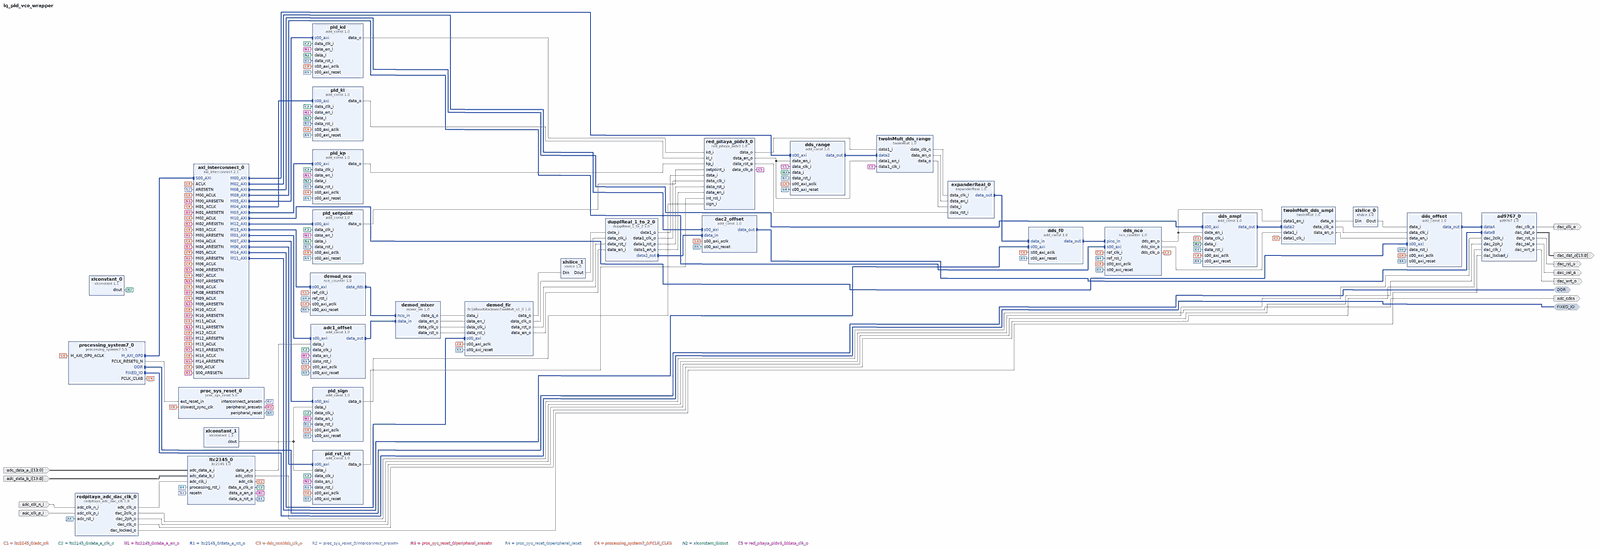
[diagram p0: block diagram of the top level, whole]
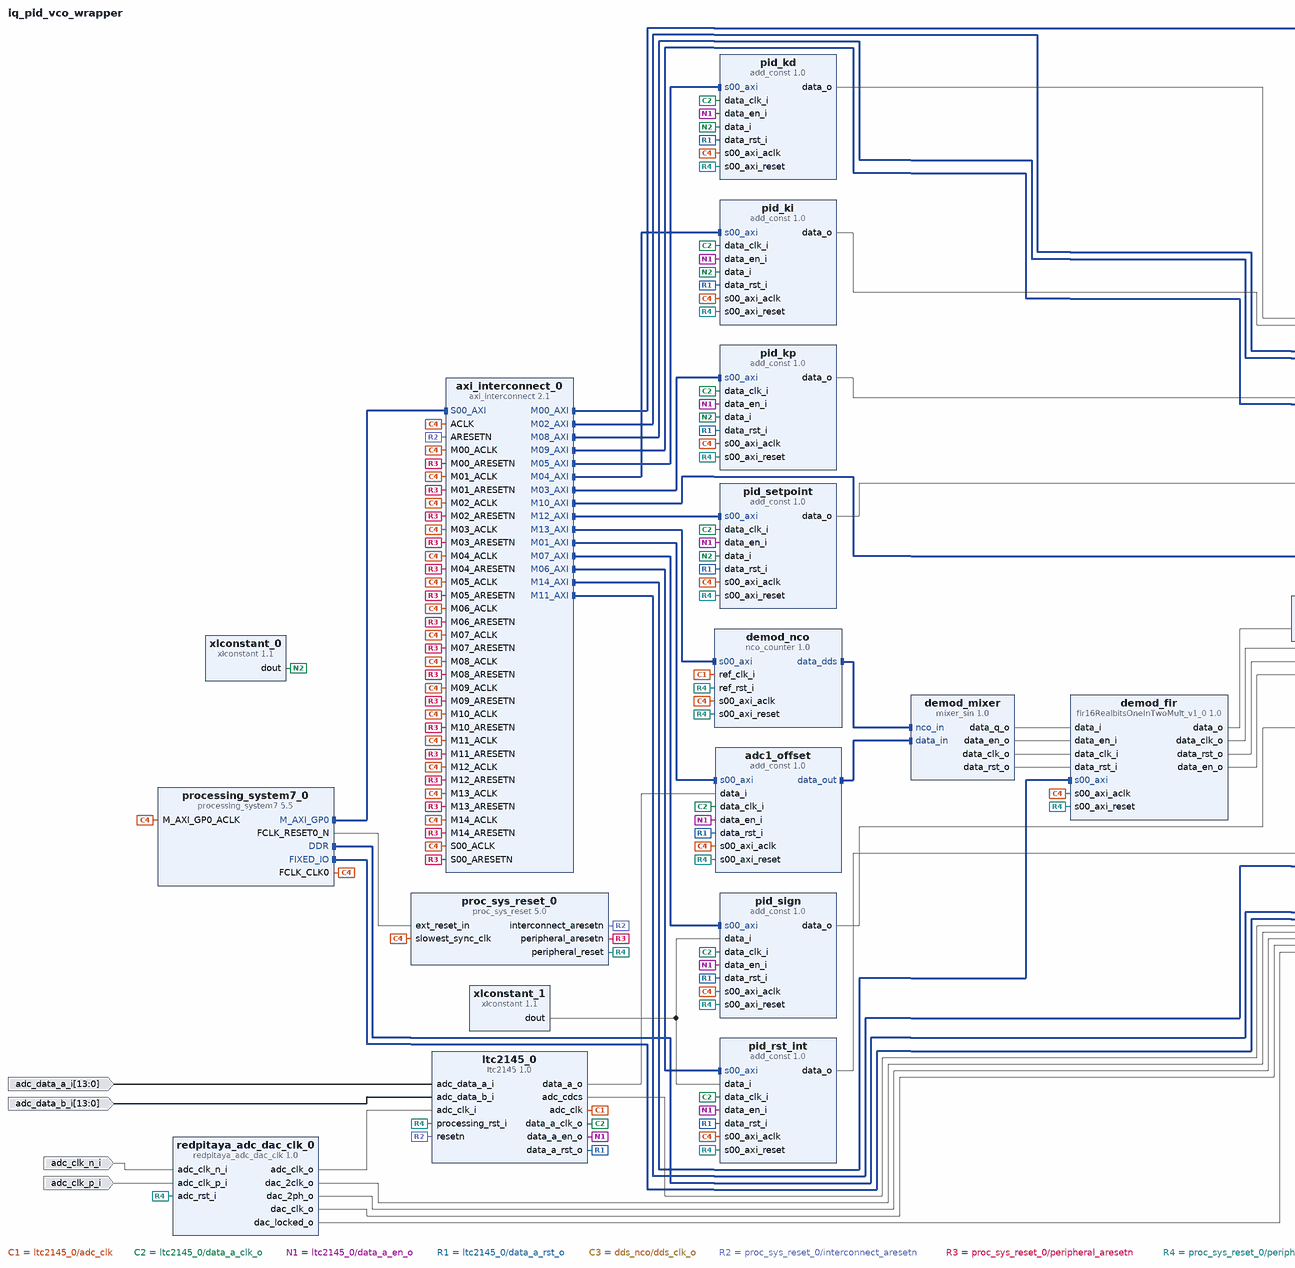
[diagram p1: block diagram of the top level, left part]
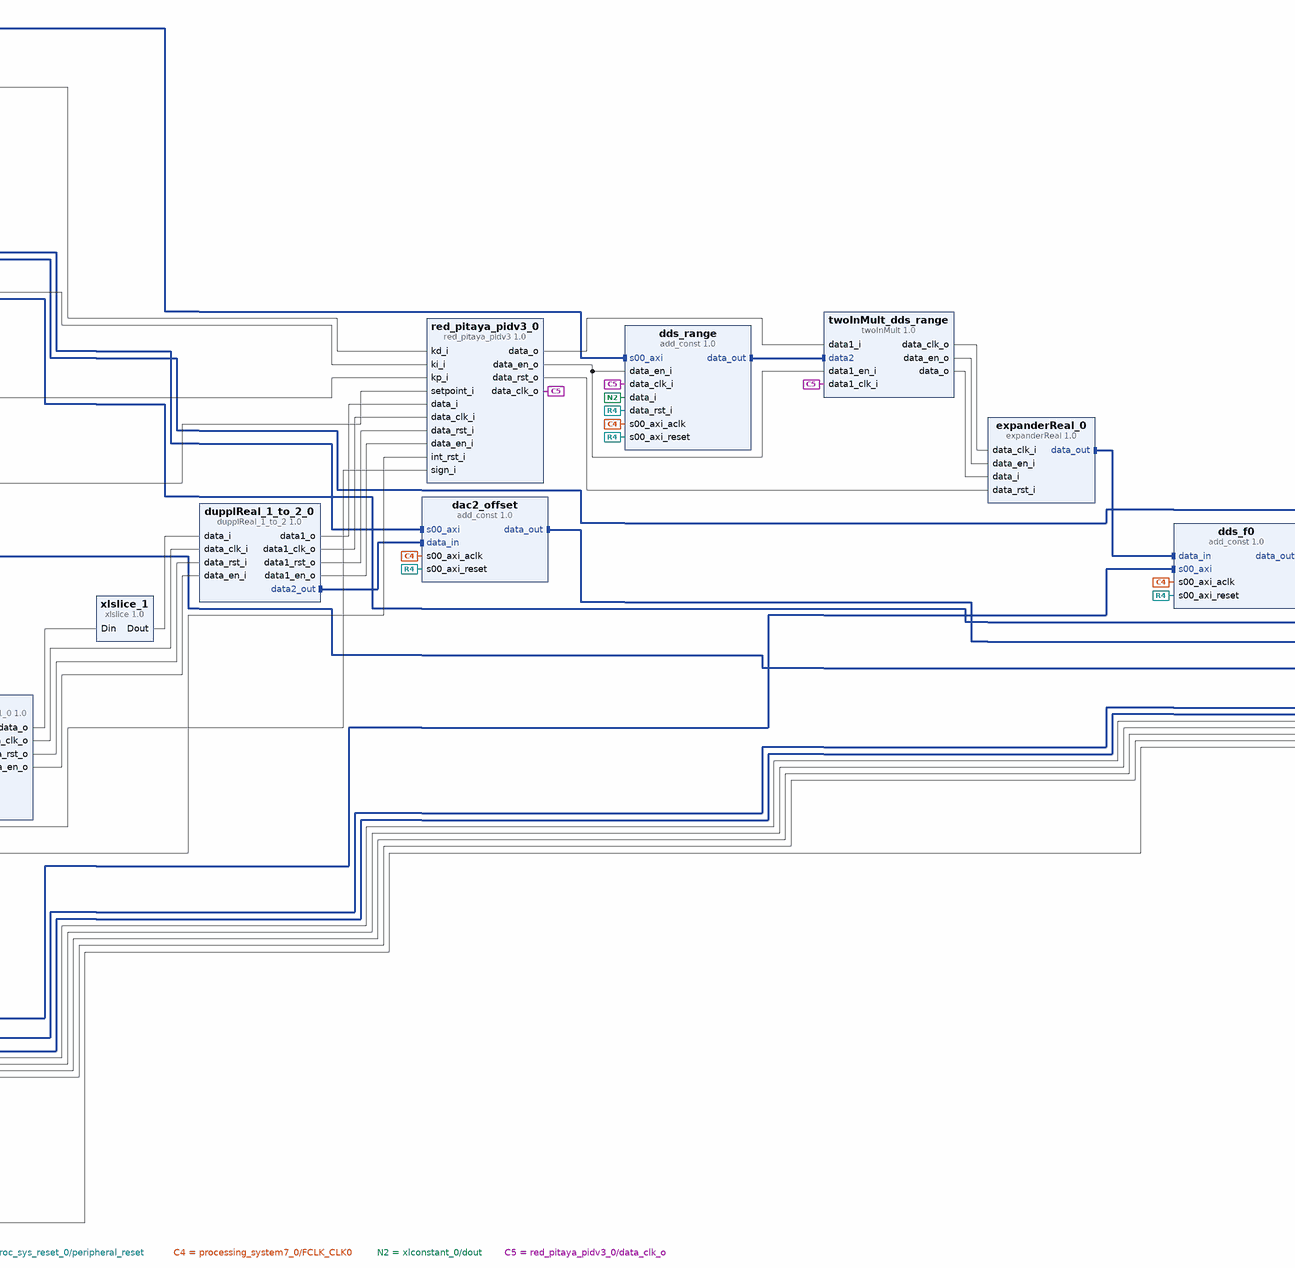
[diagram p2: block diagram of the top level, centre part]
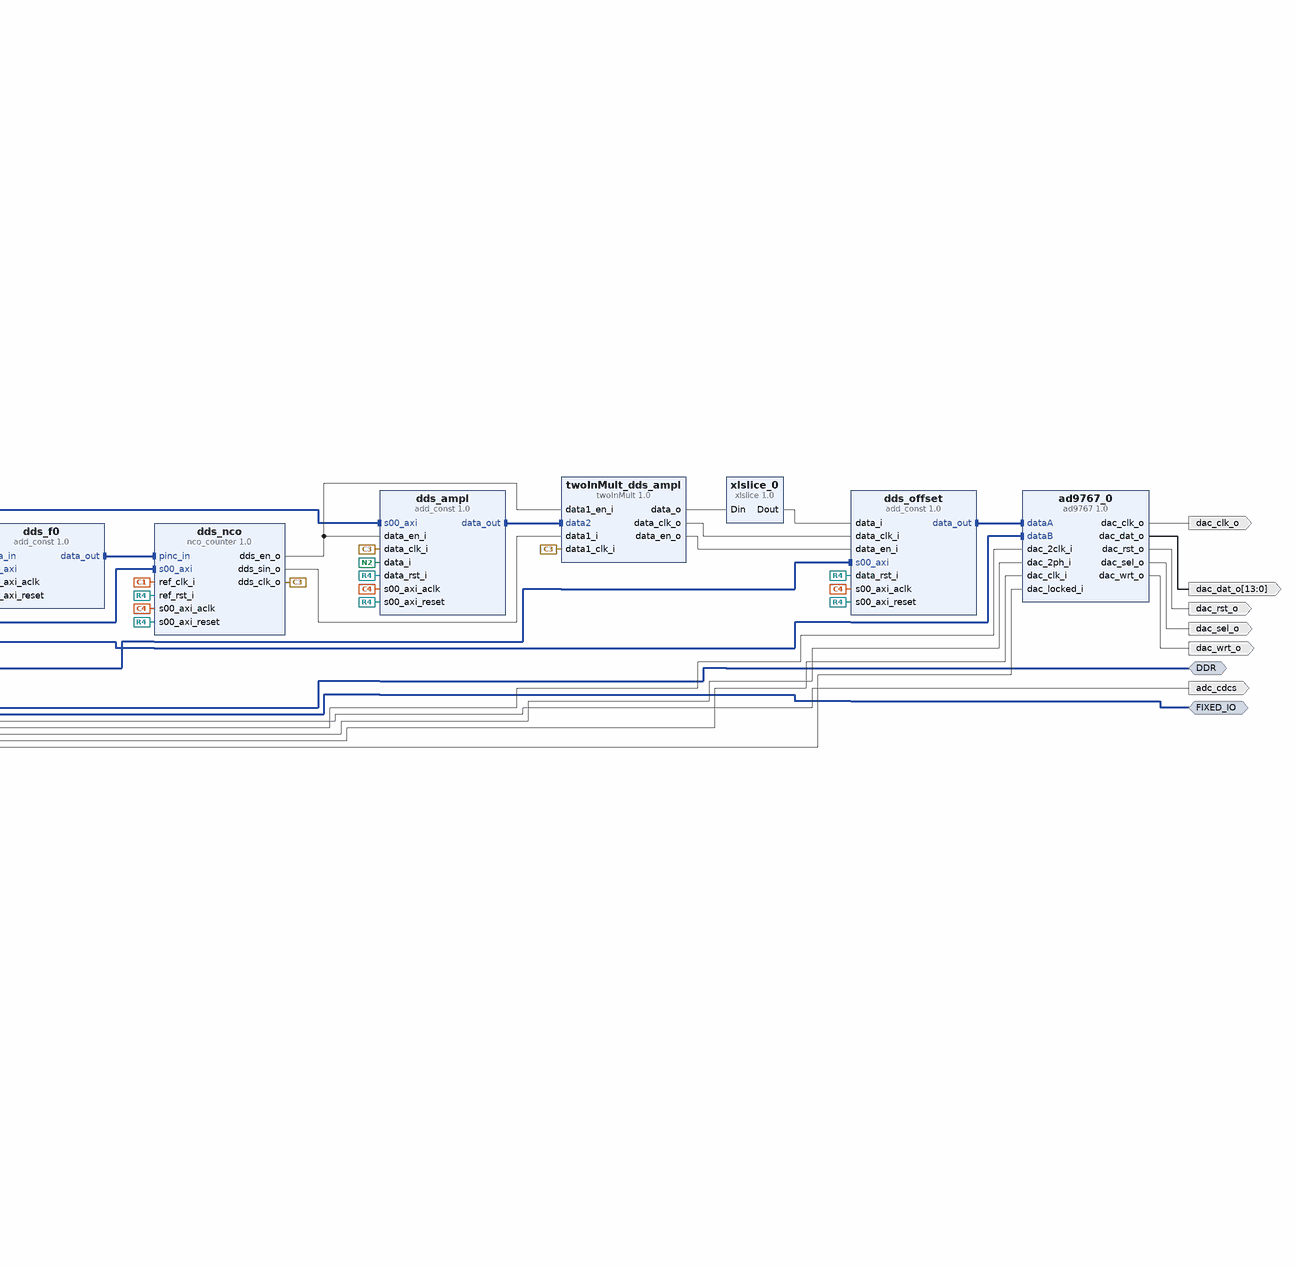
[diagram p3: block diagram of the top level, right part]
# Vivado block design iq_pid_vco_wrapper, xc7z010clg400-1, Vivado 2016.4
create_bd_design iq_pid_vco_wrapper

create_bd_intf_port -mode Master -vlnv xilinx.com:interface:ddrx_rtl:1.0 DDR
create_bd_intf_port -mode Master -vlnv xilinx.com:display_processing_system7:fixedio_rtl:1.0 FIXED_IO
create_bd_port -dir O dac_clk_o
create_bd_port -dir O -from 13 -to 0 dac_dat_o
create_bd_port -dir O dac_rst_o
create_bd_port -dir O dac_sel_o
create_bd_port -dir O dac_wrt_o
create_bd_port -dir I adc_clk_n_i
create_bd_port -dir I adc_clk_p_i
create_bd_port -dir I -from 13 -to 0 adc_data_a_i
create_bd_port -dir I -from 13 -to 0 adc_data_b_i
create_bd_port -dir O adc_cdcs

create_bd_cell -type ip -vlnv ggm:cogen:ad9767:1.0 ad9767_0
create_bd_cell -type ip -vlnv ggm:cogen:add_const:1.0 adc1_offset
set_property -dict {CONFIG.DATA_OUT_SIZE 14 CONFIG.DATA_IN_SIZE 14} [get_bd_cells adc1_offset]
create_bd_cell -type ip -vlnv xilinx.com:ip:axi_interconnect:2.1 axi_interconnect_0
set_property -dict {CONFIG.NUM_MI 15} [get_bd_cells axi_interconnect_0]
create_bd_cell -type ip -vlnv ggm:cogen:add_const:1.0 dac2_offset
set_property -dict {CONFIG.DATA_OUT_SIZE 14 CONFIG.DATA_IN_SIZE 14} [get_bd_cells dac2_offset]
create_bd_cell -type ip -vlnv ggm:cogen:add_const:1.0 dds_ampl
set_property -dict {CONFIG.format unsigned CONFIG.DATA_OUT_SIZE 14 CONFIG.DATA_IN_SIZE 14} [get_bd_cells dds_ampl]
create_bd_cell -type ip -vlnv ggm:cogen:add_const:1.0 dds_f0
set_property -dict {CONFIG.format unsigned CONFIG.DATA_OUT_SIZE 32 CONFIG.DATA_IN_SIZE 32} [get_bd_cells dds_f0]
create_bd_cell -type ip -vlnv ggm:cogen:add_const:1.0 dds_offset
set_property -dict {CONFIG.DATA_OUT_SIZE 14 CONFIG.DATA_IN_SIZE 14} [get_bd_cells dds_offset]
create_bd_cell -type ip -vlnv ggm:cogen:add_const:1.0 dds_range
set_property -dict {CONFIG.format signed CONFIG.DATA_OUT_SIZE 14 CONFIG.DATA_IN_SIZE 14} [get_bd_cells dds_range]
create_bd_cell -type ip -vlnv ggm:cogen:dupplReal_1_to_2:1.0 dupplReal_1_to_2_0
set_property -dict {CONFIG.DATA_SIZE 14} [get_bd_cells dupplReal_1_to_2_0]
create_bd_cell -type ip -vlnv ggm:cogen:expanderReal:1.0 expanderReal_0
set_property -dict {CONFIG.format signed CONFIG.DATA_IN_SIZE 28 CONFIG.DATA_OUT_SIZE 32} [get_bd_cells expanderReal_0]
create_bd_cell -type ip -vlnv ggm:cogen:add_const:1.0 pid_kd
set_property -dict {CONFIG.format unsigned CONFIG.DATA_OUT_SIZE 14 CONFIG.DATA_IN_SIZE 14} [get_bd_cells pid_kd]
create_bd_cell -type ip -vlnv ggm:cogen:add_const:1.0 pid_ki
set_property -dict {CONFIG.format unsigned CONFIG.DATA_OUT_SIZE 14 CONFIG.DATA_IN_SIZE 14} [get_bd_cells pid_ki]
create_bd_cell -type ip -vlnv ggm:cogen:add_const:1.0 pid_kp
set_property -dict [list \
  CONFIG.format unsigned \
  CONFIG.DATA_OUT_SIZE 14 \
  CONFIG.DATA_IN_SIZE 14 \
  CONFIG.C_S00_AXI_DATA_WIDTH 32 \
] [get_bd_cells pid_kp]
create_bd_cell -type ip -vlnv ggm:cogen:add_const:1.0 pid_rst_int
set_property -dict {CONFIG.format unsigned CONFIG.DATA_OUT_SIZE 1 CONFIG.DATA_IN_SIZE 1} [get_bd_cells pid_rst_int]
create_bd_cell -type ip -vlnv ggm:cogen:add_const:1.0 pid_setpoint
set_property -dict {CONFIG.format signed CONFIG.DATA_OUT_SIZE 14 CONFIG.DATA_IN_SIZE 14} [get_bd_cells pid_setpoint]
create_bd_cell -type ip -vlnv ggm:cogen:add_const:1.0 pid_sign
set_property -dict {CONFIG.format unsigned CONFIG.DATA_OUT_SIZE 1 CONFIG.DATA_IN_SIZE 1} [get_bd_cells pid_sign]
create_bd_cell -type ip -vlnv xilinx.com:ip:proc_sys_reset:5.0 proc_sys_reset_0
create_bd_cell -type ip -vlnv xilinx.com:ip:processing_system7:5.5 processing_system7_0
set_property -dict [list \
  CONFIG.PCW_FCLK_CLK1_BUF TRUE \
  CONFIG.PCW_FCLK_CLK2_BUF TRUE \
  CONFIG.PCW_FCLK_CLK3_BUF TRUE \
  CONFIG.PCW_UIPARAM_DDR_FREQ_MHZ 533.333333 \
  CONFIG.PCW_APU_PERIPHERAL_FREQMHZ 666.666666 \
  CONFIG.PCW_QSPI_PERIPHERAL_FREQMHZ 125 \
  CONFIG.PCW_SDIO_PERIPHERAL_FREQMHZ 125 \
  CONFIG.PCW_UART_PERIPHERAL_FREQMHZ 100 \
  CONFIG.PCW_I2C_PERIPHERAL_FREQMHZ 111.111115 \
  CONFIG.PCW_FPGA0_PERIPHERAL_FREQMHZ 125 \
  CONFIG.PCW_FPGA1_PERIPHERAL_FREQMHZ 250 \
  CONFIG.PCW_FPGA3_PERIPHERAL_FREQMHZ 200 \
  CONFIG.PCW_M_AXI_GP0_FREQMHZ 125 \
  CONFIG.PCW_EN_CLK1_PORT 1 \
  CONFIG.PCW_EN_CLK2_PORT 1 \
  CONFIG.PCW_EN_CLK3_PORT 1 \
  CONFIG.PCW_EN_RST1_PORT 1 \
  CONFIG.PCW_EN_RST2_PORT 1 \
  CONFIG.PCW_EN_RST3_PORT 1 \
  CONFIG.PCW_IRQ_F2P_MODE REVERSE \
  CONFIG.PCW_PERIPHERAL_BOARD_PRESET part0 \
  CONFIG.PCW_PRESET_BANK1_VOLTAGE {LVCMOS 2.5V} \
  CONFIG.PCW_UIPARAM_DDR_BUS_WIDTH {16 Bit} \
  CONFIG.PCW_UIPARAM_DDR_PARTNO {MT41J256M16 RE-125} \
  CONFIG.PCW_QSPI_PERIPHERAL_ENABLE 1 \
  CONFIG.PCW_QSPI_QSPI_IO {MIO 1 .. 6} \
  CONFIG.PCW_QSPI_GRP_SINGLE_SS_ENABLE 1 \
  CONFIG.PCW_QSPI_GRP_SINGLE_SS_IO {MIO 1 .. 6} \
  CONFIG.PCW_ENET0_PERIPHERAL_ENABLE 1 \
  CONFIG.PCW_ENET0_ENET0_IO {MIO 16 .. 27} \
  CONFIG.PCW_ENET0_GRP_MDIO_ENABLE 1 \
  CONFIG.PCW_ENET0_GRP_MDIO_IO {MIO 52 .. 53} \
  CONFIG.PCW_ENET_RESET_ENABLE 1 \
  CONFIG.PCW_ENET_RESET_SELECT {Share reset pin} \
  CONFIG.PCW_ENET0_RESET_ENABLE 0 \
  CONFIG.PCW_SD0_PERIPHERAL_ENABLE 1 \
  CONFIG.PCW_SD0_SD0_IO {MIO 40 .. 45} \
  CONFIG.PCW_SD0_GRP_CD_ENABLE 1 \
  CONFIG.PCW_SD0_GRP_CD_IO {MIO 46} \
  CONFIG.PCW_SD0_GRP_WP_ENABLE 1 \
  CONFIG.PCW_SD0_GRP_WP_IO {MIO 47} \
  CONFIG.PCW_UART0_PERIPHERAL_ENABLE 1 \
  CONFIG.PCW_UART0_UART0_IO {MIO 14 .. 15} \
  CONFIG.PCW_UART1_PERIPHERAL_ENABLE 1 \
  CONFIG.PCW_UART1_UART1_IO {MIO 8 .. 9} \
  CONFIG.PCW_SPI0_PERIPHERAL_ENABLE 1 \
  CONFIG.PCW_SPI0_SPI0_IO EMIO \
  CONFIG.PCW_SPI1_PERIPHERAL_ENABLE 1 \
  CONFIG.PCW_SPI1_SPI1_IO {MIO 10 .. 15} \
  CONFIG.PCW_TRACE_INTERNAL_WIDTH 32 \
  CONFIG.PCW_TTC0_PERIPHERAL_ENABLE 1 \
  CONFIG.PCW_TTC0_TTC0_IO EMIO \
  CONFIG.PCW_USB0_PERIPHERAL_ENABLE 1 \
  CONFIG.PCW_USB0_USB0_IO {MIO 28 .. 39} \
  CONFIG.PCW_USB_RESET_ENABLE 1 \
  CONFIG.PCW_USB_RESET_SELECT {Share reset pin} \
  CONFIG.PCW_USB0_RESET_ENABLE 1 \
  CONFIG.PCW_USB0_RESET_IO {MIO 48} \
  CONFIG.PCW_I2C0_PERIPHERAL_ENABLE 1 \
  CONFIG.PCW_I2C0_I2C0_IO {MIO 50 .. 51} \
  CONFIG.PCW_I2C0_GRP_INT_ENABLE 0 \
  CONFIG.PCW_I2C_RESET_ENABLE 1 \
  CONFIG.PCW_I2C_RESET_SELECT {Share reset pin} \
  CONFIG.PCW_GPIO_MIO_GPIO_ENABLE 1 \
  CONFIG.PCW_GPIO_MIO_GPIO_IO MIO \
  CONFIG.PCW_DCI_PERIPHERAL_CLKSRC 1 \
  CONFIG.PCW_PCAP_PERIPHERAL_CLKSRC 1 \
  CONFIG.PCW_FPGA_FCLK1_ENABLE 1 \
  CONFIG.PCW_FPGA_FCLK2_ENABLE 1 \
  CONFIG.PCW_FPGA_FCLK3_ENABLE 1 \
] [get_bd_cells processing_system7_0]
# 490 more settings of processing_system7_0 are not shown: defaults, MIO pin electricals, DDR timing, and values the tool derives
create_bd_cell -type ip -vlnv ggm:cogen:redpitaya_adc_dac_clk:1.0 redpitaya_adc_dac_clk_0
create_bd_cell -type ip -vlnv ggm:cogen:twoInMult:1.0 twoInMult_dds_ampl
set_property -dict {CONFIG.DATA_SIZE 14} [get_bd_cells twoInMult_dds_ampl]
create_bd_cell -type ip -vlnv ggm:cogen:twoInMult:1.0 twoInMult_dds_range
set_property -dict {CONFIG.format signed CONFIG.DATA_SIZE 14} [get_bd_cells twoInMult_dds_range]
create_bd_cell -type ip -vlnv xilinx.com:ip:xlconstant:1.1 xlconstant_0
set_property -dict {CONFIG.CONST_WIDTH 14 CONFIG.CONST_VAL 0} [get_bd_cells xlconstant_0]
create_bd_cell -type ip -vlnv xilinx.com:ip:xlconstant:1.1 xlconstant_1
set_property -dict {CONFIG.CONST_VAL 0} [get_bd_cells xlconstant_1]
create_bd_cell -type ip -vlnv xilinx.com:ip:xlslice:1.0 xlslice_0
set_property -dict {CONFIG.DOUT_WIDTH 14 CONFIG.DIN_TO 13 CONFIG.DIN_FROM 26 CONFIG.DIN_WIDTH 28} [get_bd_cells xlslice_0]
create_bd_cell -type ip -vlnv ggm:cogen:mixer_sin:1.0 demod_mixer
set_property -dict {CONFIG.DATA_SIZE 14 CONFIG.NCO_SIZE 14} [get_bd_cells demod_mixer]
create_bd_cell -type ip -vlnv ggm:cogen:fir16RealbitsOneInTwoMult_v1_0:1.0 demod_fir
set_property -dict [list \
  CONFIG.NB_FIR 55 \
  CONFIG.NB_COEFF 55 \
  CONFIG.DECIMATE_FACTOR 1 \
  CONFIG.DATA_IN_SIZE 14 \
  CONFIG.DATA_OUT_SIZE 28 \
] [get_bd_cells demod_fir]
create_bd_cell -type ip -vlnv xilinx.com:ip:xlslice:1.0 xlslice_1
set_property -dict {CONFIG.DOUT_WIDTH 14 CONFIG.DIN_TO 13 CONFIG.DIN_FROM 26 CONFIG.DIN_WIDTH 28} [get_bd_cells xlslice_1]
create_bd_cell -type ip -vlnv user.org:user:nco_counter:1.0 dds_nco
set_property -dict {CONFIG.DATA_SIZE 14 CONFIG.COUNTER_SIZE 32 CONFIG.LUT_SIZE 12} [get_bd_cells dds_nco]
create_bd_cell -type ip -vlnv user.org:user:nco_counter:1.0 demod_nco
set_property -dict {CONFIG.DATA_SIZE 14 CONFIG.COUNTER_SIZE 32 CONFIG.LUT_SIZE 12} [get_bd_cells demod_nco]
create_bd_cell -type ip -vlnv gwbs:user:ltc2145:1.0 ltc2145_0
create_bd_cell -type ip -vlnv user.org:user:red_pitaya_pidv3:1.0 red_pitaya_pidv3_0
set_property -dict [list \
  CONFIG.PSR 13 \
  CONFIG.ISR 19 \
  CONFIG.DSR 0 \
  CONFIG.P_SIZE 14 \
  CONFIG.I_SIZE 18 \
  CONFIG.D_SIZE 14 \
  CONFIG.DATA_OUT_SIZE 14 \
] [get_bd_cells red_pitaya_pidv3_0]

# ---- connections ----

connect_bd_intf_net [get_bd_intf_pins axi_interconnect_0/M00_AXI] [get_bd_intf_pins dds_range/s00_axi]
connect_bd_intf_net [get_bd_intf_pins axi_interconnect_0/M01_AXI] [get_bd_intf_pins adc1_offset/s00_axi]
connect_bd_intf_net [get_bd_intf_pins axi_interconnect_0/M02_AXI] [get_bd_intf_pins dac2_offset/s00_axi]
connect_bd_intf_net [get_bd_intf_pins axi_interconnect_0/M03_AXI] [get_bd_intf_pins pid_kp/s00_axi]
connect_bd_intf_net [get_bd_intf_pins axi_interconnect_0/M04_AXI] [get_bd_intf_pins pid_ki/s00_axi]
connect_bd_intf_net [get_bd_intf_pins axi_interconnect_0/M05_AXI] [get_bd_intf_pins pid_kd/s00_axi]
connect_bd_intf_net [get_bd_intf_pins axi_interconnect_0/M06_AXI] [get_bd_intf_pins pid_rst_int/s00_axi]
connect_bd_intf_net [get_bd_intf_pins axi_interconnect_0/M07_AXI] [get_bd_intf_pins pid_sign/s00_axi]
connect_bd_intf_net [get_bd_intf_pins axi_interconnect_0/M08_AXI] [get_bd_intf_pins dds_ampl/s00_axi]
connect_bd_intf_net [get_bd_intf_pins axi_interconnect_0/M09_AXI] [get_bd_intf_pins dds_nco/s00_axi]
connect_bd_intf_net [get_bd_intf_pins axi_interconnect_0/M10_AXI] [get_bd_intf_pins dds_offset/s00_axi]
connect_bd_intf_net [get_bd_intf_pins axi_interconnect_0/M11_AXI] [get_bd_intf_pins dds_f0/s00_axi]
connect_bd_intf_net [get_bd_intf_pins axi_interconnect_0/M12_AXI] [get_bd_intf_pins pid_setpoint/s00_axi]
connect_bd_intf_net -intf_net dac1_offset_data_out [get_bd_intf_pins dac2_offset/data_out] [get_bd_intf_pins ad9767_0/dataB]
connect_bd_intf_net [get_bd_intf_pins twoInMult_dds_ampl/data2] [get_bd_intf_pins dds_ampl/data_out]
connect_bd_intf_net [get_bd_intf_pins dds_nco/pinc_in] [get_bd_intf_pins dds_f0/data_out]
connect_bd_intf_net [get_bd_intf_pins dds_offset/data_out] [get_bd_intf_pins ad9767_0/dataA]
connect_bd_intf_net [get_bd_intf_pins twoInMult_dds_range/data2] [get_bd_intf_pins dds_range/data_out]
connect_bd_intf_net [get_bd_intf_pins dupplReal_1_to_2_0/data2_out] [get_bd_intf_pins dac2_offset/data_in]
connect_bd_intf_net [get_bd_intf_pins expanderReal_0/data_out] [get_bd_intf_pins dds_f0/data_in]
connect_bd_intf_net [get_bd_intf_pins processing_system7_0/M_AXI_GP0] [get_bd_intf_pins axi_interconnect_0/S00_AXI]
connect_bd_intf_net [get_bd_intf_pins demod_mixer/data_in] [get_bd_intf_pins adc1_offset/data_out]
connect_bd_intf_net [get_bd_intf_pins axi_interconnect_0/M13_AXI] [get_bd_intf_pins demod_nco/s00_axi]
connect_bd_intf_net [get_bd_intf_pins demod_nco/data_dds] [get_bd_intf_pins demod_mixer/nco_in]
connect_bd_intf_net [get_bd_intf_pins axi_interconnect_0/M14_AXI] [get_bd_intf_pins demod_fir/s00_axi]
connect_bd_intf_net [get_bd_intf_ports DDR] [get_bd_intf_pins processing_system7_0/DDR]
connect_bd_intf_net [get_bd_intf_ports FIXED_IO] [get_bd_intf_pins processing_system7_0/FIXED_IO]
connect_bd_net [get_bd_pins ad9767_0/dac_clk_o] [get_bd_ports dac_clk_o]
connect_bd_net [get_bd_pins ad9767_0/dac_dat_o] [get_bd_ports dac_dat_o]
connect_bd_net [get_bd_pins ad9767_0/dac_rst_o] [get_bd_ports dac_rst_o]
connect_bd_net [get_bd_pins ad9767_0/dac_sel_o] [get_bd_ports dac_sel_o]
connect_bd_net [get_bd_pins ad9767_0/dac_wrt_o] [get_bd_ports dac_wrt_o]
connect_bd_net [get_bd_ports adc_clk_n_i] [get_bd_pins redpitaya_adc_dac_clk_0/adc_clk_n_i]
connect_bd_net [get_bd_ports adc_clk_p_i] [get_bd_pins redpitaya_adc_dac_clk_0/adc_clk_p_i]
connect_bd_net [get_bd_ports adc_data_a_i] [get_bd_pins ltc2145_0/adc_data_a_i]
connect_bd_net [get_bd_ports adc_data_b_i] [get_bd_pins ltc2145_0/adc_data_b_i]
connect_bd_net [get_bd_pins ltc2145_0/adc_cdcs] [get_bd_ports adc_cdcs]
connect_bd_net [get_bd_pins ltc2145_0/adc_clk] [get_bd_pins dds_nco/ref_clk_i] [get_bd_pins demod_nco/ref_clk_i]
connect_bd_net [get_bd_pins ltc2145_0/data_a_clk_o] \
  [get_bd_pins adc1_offset/data_clk_i] [get_bd_pins pid_kp/data_clk_i] [get_bd_pins pid_ki/data_clk_i] \
  [get_bd_pins pid_kd/data_clk_i] [get_bd_pins pid_rst_int/data_clk_i] [get_bd_pins pid_sign/data_clk_i] \
  [get_bd_pins pid_setpoint/data_clk_i]
connect_bd_net [get_bd_pins ltc2145_0/data_a_en_o] \
  [get_bd_pins adc1_offset/data_en_i] [get_bd_pins pid_kp/data_en_i] [get_bd_pins pid_ki/data_en_i] \
  [get_bd_pins pid_kd/data_en_i] [get_bd_pins pid_rst_int/data_en_i] [get_bd_pins pid_sign/data_en_i] \
  [get_bd_pins pid_setpoint/data_en_i]
connect_bd_net [get_bd_pins ltc2145_0/data_a_o] [get_bd_pins adc1_offset/data_i]
connect_bd_net [get_bd_pins ltc2145_0/data_a_rst_o] \
  [get_bd_pins adc1_offset/data_rst_i] [get_bd_pins pid_kp/data_rst_i] [get_bd_pins pid_ki/data_rst_i] \
  [get_bd_pins pid_kd/data_rst_i] [get_bd_pins pid_rst_int/data_rst_i] [get_bd_pins pid_sign/data_rst_i] \
  [get_bd_pins pid_setpoint/data_rst_i]
connect_bd_net -net nco_counter_0_dds_clk_o [get_bd_pins dds_nco/dds_clk_o] \
  [get_bd_pins dds_ampl/data_clk_i] [get_bd_pins twoInMult_dds_ampl/data1_clk_i]
connect_bd_net -net nco_counter_0_dds_en_o [get_bd_pins dds_nco/dds_en_o] [get_bd_pins dds_ampl/data_en_i] [get_bd_pins twoInMult_dds_ampl/data1_en_i]
connect_bd_net -net nco_counter_0_dds_sin_o [get_bd_pins dds_nco/dds_sin_o] [get_bd_pins twoInMult_dds_ampl/data1_i]
connect_bd_net [get_bd_pins pid_kd/data_o] [get_bd_pins red_pitaya_pidv3_0/kd_i]
connect_bd_net [get_bd_pins pid_ki/data_o] [get_bd_pins red_pitaya_pidv3_0/ki_i]
connect_bd_net [get_bd_pins pid_kp/data_o] [get_bd_pins red_pitaya_pidv3_0/kp_i]
connect_bd_net [get_bd_pins pid_rst_int/data_o] [get_bd_pins red_pitaya_pidv3_0/int_rst_i]
connect_bd_net [get_bd_pins pid_setpoint/data_o] [get_bd_pins red_pitaya_pidv3_0/setpoint_i]
connect_bd_net [get_bd_pins pid_sign/data_o] [get_bd_pins red_pitaya_pidv3_0/sign_i]
connect_bd_net [get_bd_pins proc_sys_reset_0/interconnect_aresetn] [get_bd_pins ltc2145_0/resetn] [get_bd_pins axi_interconnect_0/ARESETN]
connect_bd_net [get_bd_pins proc_sys_reset_0/peripheral_aresetn] \
  [get_bd_pins axi_interconnect_0/S00_ARESETN] [get_bd_pins axi_interconnect_0/M00_ARESETN] \
  [get_bd_pins axi_interconnect_0/M01_ARESETN] [get_bd_pins axi_interconnect_0/M02_ARESETN] \
  [get_bd_pins axi_interconnect_0/M03_ARESETN] [get_bd_pins axi_interconnect_0/M04_ARESETN] \
  [get_bd_pins axi_interconnect_0/M05_ARESETN] [get_bd_pins axi_interconnect_0/M06_ARESETN] \
  [get_bd_pins axi_interconnect_0/M07_ARESETN] [get_bd_pins axi_interconnect_0/M08_ARESETN] \
  [get_bd_pins axi_interconnect_0/M09_ARESETN] [get_bd_pins axi_interconnect_0/M10_ARESETN] \
  [get_bd_pins axi_interconnect_0/M11_ARESETN] [get_bd_pins axi_interconnect_0/M12_ARESETN] \
  [get_bd_pins axi_interconnect_0/M13_ARESETN] [get_bd_pins axi_interconnect_0/M14_ARESETN]
connect_bd_net [get_bd_pins proc_sys_reset_0/peripheral_reset] \
  [get_bd_pins redpitaya_adc_dac_clk_0/adc_rst_i] [get_bd_pins dac2_offset/s00_axi_reset] \
  [get_bd_pins dds_ampl/s00_axi_reset] [get_bd_pins dds_offset/s00_axi_reset] [get_bd_pins dds_offset/data_rst_i] \
  [get_bd_pins dds_ampl/data_rst_i] [get_bd_pins dds_f0/s00_axi_reset] [get_bd_pins adc1_offset/s00_axi_reset] \
  [get_bd_pins dds_range/s00_axi_reset] [get_bd_pins dds_range/data_rst_i] [get_bd_pins pid_kp/s00_axi_reset] \
  [get_bd_pins pid_ki/s00_axi_reset] [get_bd_pins pid_kd/s00_axi_reset] [get_bd_pins pid_rst_int/s00_axi_reset] \
  [get_bd_pins pid_sign/s00_axi_reset] [get_bd_pins pid_setpoint/s00_axi_reset] [get_bd_pins demod_fir/s00_axi_reset] \
  [get_bd_pins dds_nco/ref_rst_i] [get_bd_pins dds_nco/s00_axi_reset] [get_bd_pins demod_nco/ref_rst_i] \
  [get_bd_pins demod_nco/s00_axi_reset] [get_bd_pins ltc2145_0/processing_rst_i]
connect_bd_net [get_bd_pins processing_system7_0/FCLK_CLK0] \
  [get_bd_pins processing_system7_0/M_AXI_GP0_ACLK] [get_bd_pins proc_sys_reset_0/slowest_sync_clk] \
  [get_bd_pins dac2_offset/s00_axi_aclk] [get_bd_pins dds_ampl/s00_axi_aclk] [get_bd_pins dds_offset/s00_axi_aclk] \
  [get_bd_pins dds_f0/s00_axi_aclk] [get_bd_pins adc1_offset/s00_axi_aclk] [get_bd_pins dds_range/s00_axi_aclk] \
  [get_bd_pins pid_kp/s00_axi_aclk] [get_bd_pins pid_ki/s00_axi_aclk] [get_bd_pins pid_kd/s00_axi_aclk] \
  [get_bd_pins pid_rst_int/s00_axi_aclk] [get_bd_pins pid_sign/s00_axi_aclk] [get_bd_pins pid_setpoint/s00_axi_aclk] \
  [get_bd_pins demod_fir/s00_axi_aclk] [get_bd_pins dds_nco/s00_axi_aclk] [get_bd_pins demod_nco/s00_axi_aclk] \
  [get_bd_pins axi_interconnect_0/ACLK] [get_bd_pins axi_interconnect_0/S00_ACLK] [get_bd_pins axi_interconnect_0/M00_ACLK] \
  [get_bd_pins axi_interconnect_0/M01_ACLK] [get_bd_pins axi_interconnect_0/M02_ACLK] \
  [get_bd_pins axi_interconnect_0/M03_ACLK] [get_bd_pins axi_interconnect_0/M04_ACLK] \
  [get_bd_pins axi_interconnect_0/M05_ACLK] [get_bd_pins axi_interconnect_0/M06_ACLK] \
  [get_bd_pins axi_interconnect_0/M07_ACLK] [get_bd_pins axi_interconnect_0/M08_ACLK] \
  [get_bd_pins axi_interconnect_0/M09_ACLK] [get_bd_pins axi_interconnect_0/M10_ACLK] \
  [get_bd_pins axi_interconnect_0/M11_ACLK] [get_bd_pins axi_interconnect_0/M12_ACLK] \
  [get_bd_pins axi_interconnect_0/M13_ACLK] [get_bd_pins axi_interconnect_0/M14_ACLK]
connect_bd_net [get_bd_pins processing_system7_0/FCLK_RESET0_N] [get_bd_pins proc_sys_reset_0/ext_reset_in]
connect_bd_net [get_bd_pins redpitaya_adc_dac_clk_0/adc_clk_o] [get_bd_pins ltc2145_0/adc_clk_i]
connect_bd_net [get_bd_pins redpitaya_adc_dac_clk_0/dac_2clk_o] [get_bd_pins ad9767_0/dac_2clk_i]
connect_bd_net [get_bd_pins redpitaya_adc_dac_clk_0/dac_2ph_o] [get_bd_pins ad9767_0/dac_2ph_i]
connect_bd_net [get_bd_pins redpitaya_adc_dac_clk_0/dac_clk_o] [get_bd_pins ad9767_0/dac_clk_i]
connect_bd_net [get_bd_pins redpitaya_adc_dac_clk_0/dac_locked_o] [get_bd_pins ad9767_0/dac_locked_i]
connect_bd_net -net twoInMult_0_data_clk_o [get_bd_pins twoInMult_dds_ampl/data_clk_o] [get_bd_pins dds_offset/data_clk_i]
connect_bd_net -net twoInMult_0_data_en_o [get_bd_pins twoInMult_dds_ampl/data_en_o] [get_bd_pins dds_offset/data_en_i]
connect_bd_net -net twoInMult_0_data_o [get_bd_pins twoInMult_dds_ampl/data_o] [get_bd_pins xlslice_0/Din]
connect_bd_net [get_bd_pins twoInMult_dds_range/data_clk_o] [get_bd_pins expanderReal_0/data_clk_i]
connect_bd_net [get_bd_pins twoInMult_dds_range/data_en_o] [get_bd_pins expanderReal_0/data_en_i]
connect_bd_net [get_bd_pins twoInMult_dds_range/data_o] [get_bd_pins expanderReal_0/data_i]
connect_bd_net [get_bd_pins xlconstant_0/dout] \
  [get_bd_pins dds_ampl/data_i] [get_bd_pins dds_range/data_i] [get_bd_pins pid_kp/data_i] [get_bd_pins pid_ki/data_i] \
  [get_bd_pins pid_kd/data_i] [get_bd_pins pid_setpoint/data_i]
connect_bd_net [get_bd_pins xlconstant_1/dout] [get_bd_pins pid_rst_int/data_i] [get_bd_pins pid_sign/data_i]
connect_bd_net [get_bd_pins xlslice_0/Dout] [get_bd_pins dds_offset/data_i]
connect_bd_net -net mixer_sin_0_data_q_o [get_bd_pins demod_mixer/data_q_o] [get_bd_pins demod_fir/data_i]
connect_bd_net -net mixer_sin_0_data_en_o [get_bd_pins demod_mixer/data_en_o] [get_bd_pins demod_fir/data_en_i]
connect_bd_net -net mixer_sin_0_data_clk_o [get_bd_pins demod_mixer/data_clk_o] [get_bd_pins demod_fir/data_clk_i]
connect_bd_net -net mixer_sin_0_data_rst_o [get_bd_pins demod_mixer/data_rst_o] [get_bd_pins demod_fir/data_rst_i]
connect_bd_net -net fir16RealbitsOneInTwoMult_v1_0_0_data_o [get_bd_pins demod_fir/data_o] [get_bd_pins xlslice_1/Din]
connect_bd_net [get_bd_pins red_pitaya_pidv3_0/data_en_o] [get_bd_pins dds_range/data_en_i] [get_bd_pins twoInMult_dds_range/data1_en_i]
connect_bd_net [get_bd_pins red_pitaya_pidv3_0/data_o] [get_bd_pins twoInMult_dds_range/data1_i]
connect_bd_net [get_bd_pins red_pitaya_pidv3_0/data_clk_o] [get_bd_pins dds_range/data_clk_i] [get_bd_pins twoInMult_dds_range/data1_clk_i]
connect_bd_net [get_bd_pins red_pitaya_pidv3_0/data_rst_o] [get_bd_pins expanderReal_0/data_rst_i]
connect_bd_net [get_bd_pins xlslice_1/Dout] [get_bd_pins dupplReal_1_to_2_0/data_i]
connect_bd_net [get_bd_pins demod_fir/data_clk_o] [get_bd_pins dupplReal_1_to_2_0/data_clk_i]
connect_bd_net [get_bd_pins demod_fir/data_rst_o] [get_bd_pins dupplReal_1_to_2_0/data_rst_i]
connect_bd_net [get_bd_pins demod_fir/data_en_o] [get_bd_pins dupplReal_1_to_2_0/data_en_i]
connect_bd_net [get_bd_pins dupplReal_1_to_2_0/data1_o] [get_bd_pins red_pitaya_pidv3_0/data_i]
connect_bd_net [get_bd_pins dupplReal_1_to_2_0/data1_clk_o] [get_bd_pins red_pitaya_pidv3_0/data_clk_i]
connect_bd_net [get_bd_pins dupplReal_1_to_2_0/data1_rst_o] [get_bd_pins red_pitaya_pidv3_0/data_rst_i]
connect_bd_net [get_bd_pins dupplReal_1_to_2_0/data1_en_o] [get_bd_pins red_pitaya_pidv3_0/data_en_i]

# ---- address map ----
assign_bd_address -offset 0x43C00000 -range 64K -target_address_space [get_bd_addr_spaces processing_system7_0/Data] [get_bd_addr_segs adc1_offset/s00_axi/reg0]
assign_bd_address -offset 0x43C10000 -range 64K -target_address_space [get_bd_addr_spaces processing_system7_0/Data] [get_bd_addr_segs dac2_offset/s00_axi/reg0]
assign_bd_address -offset 0x43C20000 -range 64K -target_address_space [get_bd_addr_spaces processing_system7_0/Data] [get_bd_addr_segs dds_ampl/s00_axi/reg0]
assign_bd_address -offset 0x43C30000 -range 64K -target_address_space [get_bd_addr_spaces processing_system7_0/Data] [get_bd_addr_segs dds_f0/s00_axi/reg0]
assign_bd_address -offset 0x43C40000 -range 64K -target_address_space [get_bd_addr_spaces processing_system7_0/Data] [get_bd_addr_segs dds_offset/s00_axi/reg0]
assign_bd_address -offset 0x43C50000 -range 64K -target_address_space [get_bd_addr_spaces processing_system7_0/Data] [get_bd_addr_segs dds_range/s00_axi/reg0]
assign_bd_address -offset 0x43C60000 -range 64K -target_address_space [get_bd_addr_spaces processing_system7_0/Data] [get_bd_addr_segs pid_kp/s00_axi/reg0]
assign_bd_address -offset 0x43C70000 -range 64K -target_address_space [get_bd_addr_spaces processing_system7_0/Data] [get_bd_addr_segs pid_ki/s00_axi/reg0]
assign_bd_address -offset 0x43C80000 -range 64K -target_address_space [get_bd_addr_spaces processing_system7_0/Data] [get_bd_addr_segs pid_kd/s00_axi/reg0]
assign_bd_address -offset 0x43C90000 -range 64K -target_address_space [get_bd_addr_spaces processing_system7_0/Data] [get_bd_addr_segs pid_rst_int/s00_axi/reg0]
assign_bd_address -offset 0x43CA0000 -range 64K -target_address_space [get_bd_addr_spaces processing_system7_0/Data] [get_bd_addr_segs dds_nco/s00_axi/reg0]
assign_bd_address -offset 0x43CB0000 -range 64K -target_address_space [get_bd_addr_spaces processing_system7_0/Data] [get_bd_addr_segs pid_sign/s00_axi/reg0]
assign_bd_address -offset 0x43CC0000 -range 64K -target_address_space [get_bd_addr_spaces processing_system7_0/Data] [get_bd_addr_segs pid_setpoint/s00_axi/reg0]
assign_bd_address -offset 0x43CD0000 -range 64K -target_address_space [get_bd_addr_spaces processing_system7_0/Data] [get_bd_addr_segs demod_nco/s00_axi/reg0]
assign_bd_address -offset 0x43CE0000 -range 64K -target_address_space [get_bd_addr_spaces processing_system7_0/Data] [get_bd_addr_segs demod_fir/s00_axi/reg0]

validate_bd_design
save_bd_design
